# Altium schematic sheet connector.SchDoc
size A4
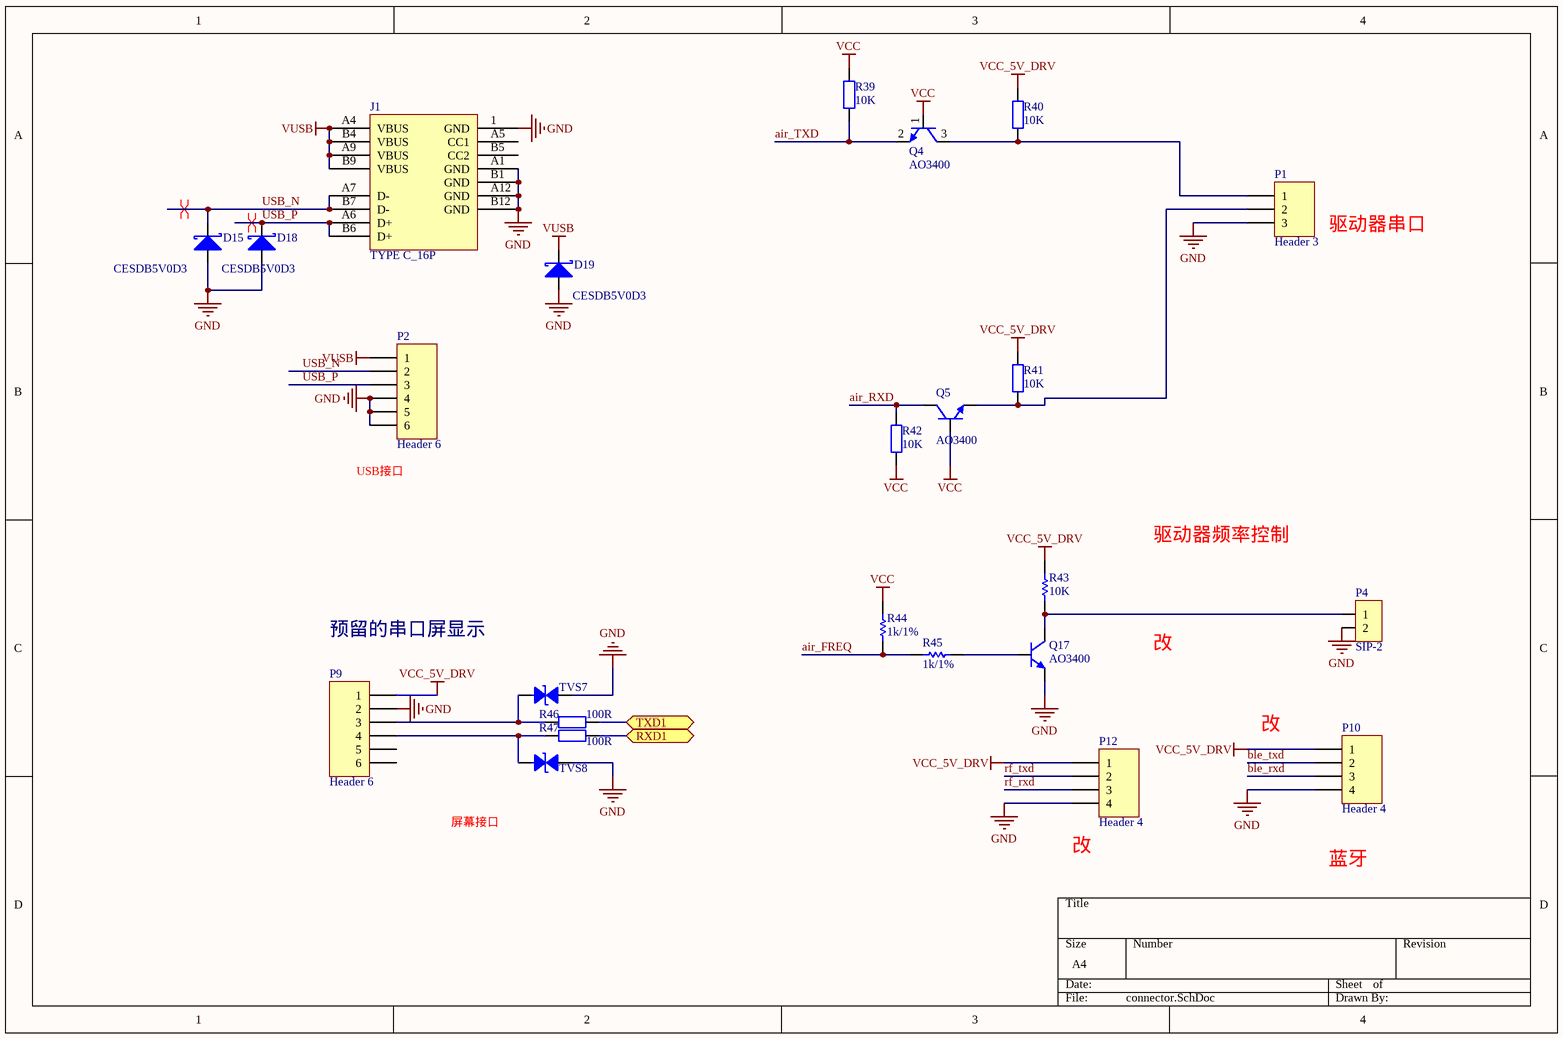
[diagram p0: connector.SchDoc]

## Parts
D15  CESDB5V0D3  [SOD323]
D18  CESDB5V0D3  [SOD323]
D19  CESDB5V0D3  [SOD323]
J1  TYPE C_16P  [TYPEC_16P]
P1  Header 3  [3X2.54MMZ]
P2  Header 6  [USB-A]
P4  SIP-2  [SIP-2A]
P9  Header 6  [6X2MMZ]
P10  Header 4  [4X2.54MMZ]
P12  Header 4  [4X2.54MMZ]
Q4  AO3400  [SOT-23]
Q5  AO3400  [SOT-23]
Q17  AO3400  [SOT23-3]
R39  10K  [0603r]
R40  10K  [0603r]
R41  10K  [0603r]
R42  10K  [0603r]
R43  10K  [0603R]
R44  1k/1%  [0603R]
R45  1k/1%  [0603R]
R46  100R  [0603R]
R47  100R  [0603R]
TVS7  ESD5Z5.0CT1G  [SOD-523]  (value not drawn)
TVS8  ESD5Z5.0CT1G  [SOD-523]  (value not drawn)

## Ports
RXD1 (bidir), TXD1 (bidir)

## Nets
GND: D15.1(A) D18.1(A) D19.1(A) J1.1(GND) J1.A1(GND) J1.A12(GND) J1.B1(GND) J1.B12(GND) P1.3 P2.4 P2.5 P2.6 P4.2 P9.2 P10.4 P12.4 Q17.2(E) TVS7.1(A) TVS8.1(A)
VCC: Q4.1(B) Q5.1(B) R39.2 R42.1 R44.1
VCC_5V_DRV: P9.1 P10.1 P12.1 R40.2 R41.2 R43.2
VUSB: D19.2(K) J1.A4(VBUS) J1.A9(VBUS) J1.B4(VBUS) J1.B9(VBUS) P2.1
air_FREQ: R44.2 R45.2
air_RXD: Q5.3(C) R42.2
air_TXD: Q4.2(E) R39.1
ble_rxd: P10.3
ble_txd: P10.2
rf_rxd: P12.3
rf_txd: P12.2
RXD1: R47.2 ; port RXD1
TXD1: R46.2 ; port TXD1
USB_N: D15.2(K) J1.A7(D-) J1.B7(D-) P2.2
USB_P: D18.2(K) J1.A6(D+) J1.B6(D+) P2.3
NetP1_1: P1.1 Q4.3(C) R40.1
NetP1_2: P1.2 Q5.2(E) R41.1
NetP4_1: P4.1 Q17.3(C) R43.1
NetP9_3: P9.3 R46.1 TVS7.2(B)
NetP9_4: P9.4 R47.1 TVS8.2(B)
NetQ17_1: Q17.1(B) R45.1

Not connected (* = marked no-connect by the designer): J1 A5(CC1) B5(CC2); P9 5 6

## Layout directives
differential pair: USB_N, USB_P

## Notes on the sheet
- 驱动器串口
- (near P2) USB接口
- 驱动器频率控制
- 预留的串口屏显示
- 改
- 屏幕接口
- (near P12) 改
- 蓝牙

## Library data of the parts
D15 D18 D19 = DIODE S: Schottky Diode
P1 = Header 3: Header, 3-Pin; LatestRevisionDate: 17-Jul-2002; LatestRevisionNote: Re-released for DXP Platform.; Publisher: Altium Limited
P2 P9 = Header 6: Header, 6-Pin; LatestRevisionDate: 17-Jul-2002; LatestRevisionNote: Re-released for DXP Platform.; Publisher: Altium Limited
P4 = SIP-2: XH2.54 2P 立贴
P10 P12 = Header 4: Header, 4-Pin; LatestRevisionDate: 17-Jul-2002; LatestRevisionNote: Re-released for DXP Platform.; Publisher: Altium Limited
Q4 Q5 Q17 = NPN-1: NPN
R39-R42 = R: 贴片电阻 1%
R43-R45 = Res1: Resistor; Published: 8-Jun-2000; LatestRevisionDate: 17-Jul-2002; LatestRevisionNote: Re-released for DXP Platform.; PackageReference: AXIAL-0.3; Publisher: Altium Limited
R46 R47 = RES2: 贴片电阻 5%
TVS7 TVS8 = TVS-1: TVS